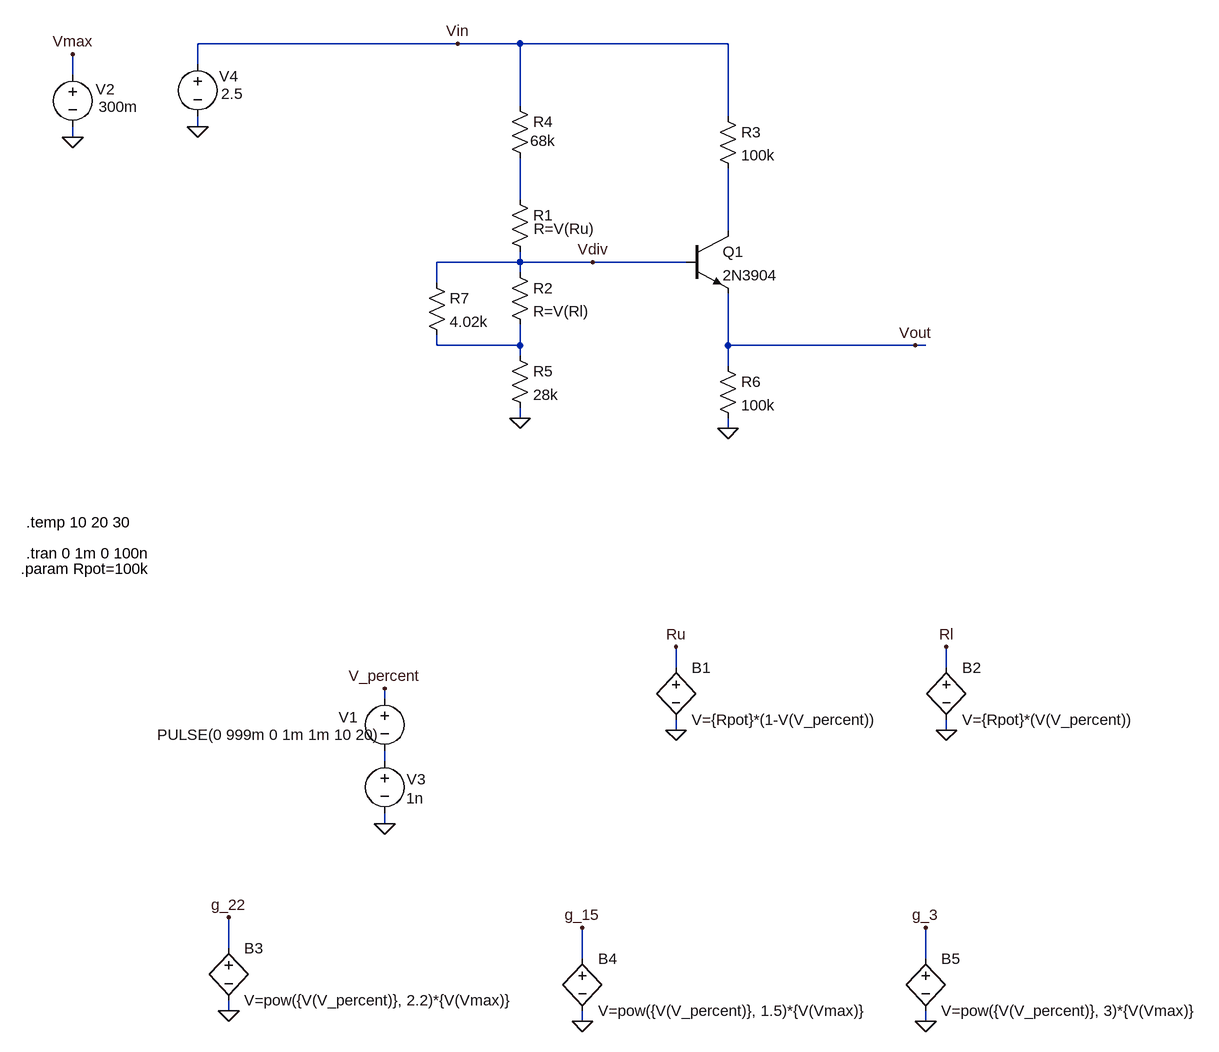
[diagram p0: schematic gammaCorrection4.asc]
gammaCorrection4.asc, the LTspice schematic file:
Version 4
SHEET 1 1748 692
WIRE -176 -848 -576 -848
WIRE -80 -848 -176 -848
WIRE 240 -848 -80 -848
WIRE -576 -816 -576 -848
WIRE -768 -800 -768 -832
WIRE -80 -752 -80 -848
WIRE 240 -736 240 -848
WIRE -576 -720 -576 -736
WIRE -768 -704 -768 -720
WIRE -80 -608 -80 -672
WIRE 240 -560 240 -656
WIRE -80 -512 -80 -528
WIRE -80 -512 -208 -512
WIRE 32 -512 -80 -512
WIRE 176 -512 32 -512
WIRE -80 -496 -80 -512
WIRE -208 -480 -208 -512
WIRE -208 -384 -208 -400
WIRE -80 -384 -80 -416
WIRE -80 -384 -208 -384
WIRE 240 -384 240 -464
WIRE 528 -384 240 -384
WIRE 544 -384 528 -384
WIRE -80 -368 -80 -384
WIRE 240 -352 240 -384
WIRE -80 -272 -80 -288
WIRE 240 -256 240 -272
WIRE 160 112 160 80
WIRE 576 112 576 80
WIRE -288 160 -288 144
WIRE 160 208 160 192
WIRE 576 208 576 192
WIRE -288 256 -288 240
WIRE -288 352 -288 336
WIRE -528 544 -528 496
WIRE 16 560 16 512
WIRE 544 560 544 512
WIRE -528 640 -528 624
WIRE 16 656 16 640
WIRE 544 656 544 640
FLAG -288 352 0
FLAG -288 144 V_percent
FLAG 160 208 0
FLAG 160 80 Ru
FLAG 576 208 0
FLAG 576 80 Rl
FLAG -176 -848 Vin
FLAG -528 640 0
FLAG -528 496 g_22
FLAG 16 656 0
FLAG 16 512 g_15
FLAG 544 656 0
FLAG 544 512 g_3
FLAG -576 -720 0
FLAG -768 -832 Vmax
FLAG -768 -704 0
FLAG -80 -272 0
FLAG 528 -384 Vout
FLAG 240 -256 0
FLAG 32 -512 Vdiv
SYMBOL voltage -288 144 R0
WINDOW 0 -71 44 Left 2
WINDOW 3 -350 71 Left 2
WINDOW 123 0 0 Left 0
WINDOW 39 0 0 Left 0
SYMATTR InstName V1
SYMATTR Value PULSE(0 999m 0 1m 1m 10 20)
SYMBOL res -96 -624 R0
WINDOW 3 37 61 Left 2
SYMATTR InstName R1
SYMATTR Value R=V(Ru)
SYMBOL res -96 -512 R0
SYMATTR InstName R2
SYMATTR Value R=V(Rl)
SYMBOL bv 160 96 R0
SYMATTR InstName B1
SYMATTR Value V={Rpot}*(1-V(V_percent))
SYMBOL bv 576 96 R0
SYMATTR InstName B2
SYMATTR Value V={Rpot}*(V(V_percent))
SYMBOL voltage -288 240 R0
WINDOW 0 34 44 Left 2
WINDOW 3 33 73 Left 2
WINDOW 123 0 0 Left 0
WINDOW 39 0 0 Left 0
SYMATTR InstName V3
SYMATTR Value 1n
SYMBOL bv -528 528 R0
SYMATTR InstName B3
SYMATTR Value V=pow({V(V_percent)}, 2.2)*{V(Vmax)}
SYMBOL bv 16 544 R0
SYMATTR InstName B4
SYMATTR Value V=pow({V(V_percent)}, 1.5)*{V(Vmax)}
SYMBOL bv 544 544 R0
SYMATTR InstName B5
SYMATTR Value V=pow({V(V_percent)}, 3)*{V(Vmax)}
SYMBOL voltage -576 -832 R0
WINDOW 0 33 34 Left 2
WINDOW 3 36 61 Left 2
WINDOW 123 0 0 Left 0
WINDOW 39 0 0 Left 0
SYMATTR InstName V4
SYMATTR Value 2.5
SYMBOL res -96 -768 R0
WINDOW 3 32 69 Left 2
SYMATTR Value 68k
SYMATTR InstName R4
SYMBOL voltage -768 -816 R0
WINDOW 0 35 38 Left 2
WINDOW 3 40 65 Left 2
WINDOW 123 0 0 Left 0
WINDOW 39 0 0 Left 0
SYMATTR InstName V2
SYMATTR Value 300m
SYMBOL npn 176 -560 R0
SYMATTR InstName Q1
SYMATTR Value 2N3904
SYMBOL res -96 -384 R0
SYMATTR InstName R5
SYMATTR Value 28k
SYMBOL res 224 -752 R0
SYMATTR InstName R3
SYMATTR Value 100k
SYMBOL res 224 -368 R0
SYMATTR InstName R6
SYMATTR Value 100k
SYMBOL res -224 -496 R0
SYMATTR InstName R7
SYMATTR Value 4.02k
TEXT -848 -40 Left 2 !.param Rpot=100k
TEXT -840 -64 Left 2 !.tran 0 1m 0 100n
TEXT -840 -112 Left 2 !.temp 10 20 30

The netlist it stands for:
* gammaCorrection4.asc
V1 V_percent N004 PULSE(0 999m 0 1m 1m 10 20)
R1 N001 Vdiv R=V(Ru)
R2 Vdiv N003 R=V(Rl)
B1 Ru 0 V={Rpot}*(1-V(V_percent))
B2 Rl 0 V={Rpot}*(V(V_percent))
V3 N004 0 1n
B3 g_22 0 V=pow({V(V_percent)}, 2.2)*{V(Vmax)}
B4 g_15 0 V=pow({V(V_percent)}, 1.5)*{V(Vmax)}
B5 g_3 0 V=pow({V(V_percent)}, 3)*{V(Vmax)}
V4 Vin 0 2.5
R4 Vin N001 68k
V2 Vmax 0 300m
Q1 N002 Vdiv Vout 0 2N3904
R5 N003 0 28k
R3 Vin N002 100k
R6 Vout 0 100k
R7 Vdiv N003 4.02k
.model NPN NPN
.model PNP PNP
.lib standard.bjt
.param Rpot=100k
.tran 0 1m 0 100n
.temp 10 20 30
.backanno
.end